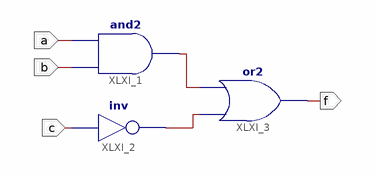
[diagram p0: schematic sheet 1]
// Xilinx ISE schematic simpleGate.sch (spartan3e) as structural Verilog: 3 symbols, 4 ports
module simpleGate (
  input  b,
  input  a,
  input  c,
  output f
);

  wire XLXN_1, XLXN_2;

  and XLXI_1 (XLXN_1, b, a);
  or XLXI_3 (f, XLXN_2, XLXN_1);
  not XLXI_2 (XLXN_2, c);
endmodule
